# Altium project PWM.PrjPcb
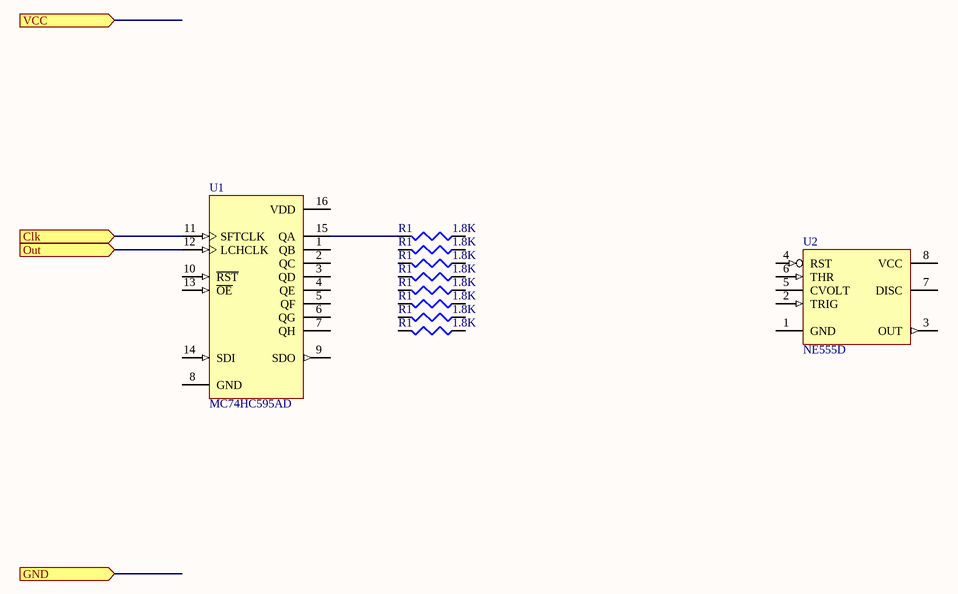
[diagram p0: Output.SchDoc]
1 sheet, 10 parts. Net scope: flat (ports and power ports of the same name join across sheets).

## Sheet Output.SchDoc
size A4

### Parts
(Parts that share a designator on the sheet are numbered #1, #2 ... from top to bottom, then left to right.)
R1#1  value 1.8K  [J1-0603]  (hidden comment: Res3)
R1#2  value 1.8K  [J1-0603]  (hidden comment: Res3)
R1#3  value 1.8K  [J1-0603]  (hidden comment: Res3)
R1#4  value 1.8K  [J1-0603]  (hidden comment: Res3)
R1#5  value 1.8K  [J1-0603]  (hidden comment: Res3)
R1#6  value 1.8K  [J1-0603]  (hidden comment: Res3)
R1#7  value 1.8K  [J1-0603]  (hidden comment: Res3)
R1#8  value 1.8K  [J1-0603]  (hidden comment: Res3)
U1  MC74HC595AD  [751B-05_N]
U2  NE555D  [SO8_N]

### Ports
Clk (in), GND (in), Out (in), VCC (in)

### Nets
NetR1#1_2: R1#1.2 U1.15(QA)
NetU1_11: U1.11(SFTCLK) ; port Clk
NetU1_12: U1.12(LCHCLK) ; port Out

Not connected (* = marked no-connect by the designer): R1#1 1; R1#2 1 2; R1#3 1 2; R1#4 1 2; R1#5 1 2; R1#6 1 2; R1#7 1 2; R1#8 1 2; U1 1(QB) 2(QC) 3(QD) 4(QE) 5(QF) 6(QG) 7(QH) 8(GND) 9(SDO) 10(~{RST}) 13(~{OE}) 14(SDI) 16(VDD); U2 1(GND) 2(TRIG) 3(OUT) 4(RST) 5(CVOLT) 6(THR) 7(DISC) 8(VCC)

### Library data of the parts
R1#1-R1#8 = Res3: Resistor; Published: 8-Jun-2000; LatestRevisionDate: 29-May-2009; LatestRevisionNote: IPC-7351 Footprint Added.; PackageReference: J1-0603; Publisher: Altium Limited; PackageDescription: Chip Resistor
U1 = MC74HC595AD: 8-Bit Serial-Input/Serial or Prallel-Output Shift Register with Latched 3-State Outputs; Published: 15-Apr-2002; LatestRevisionDate: 13-Apr-2006; LatestRevisionNote: IPC-7351 Footprint Added.; DatasheetVersion: Mar-2000; PackageVersion: Oct-1999; PackageReference: 751B-05; Publisher: Altium Limited; PackageDescription: 16-Pin Small Outline Integrated Circuit 1.27 mm Pitch; Code_JEDEC: MS-012-AC; Code_IPC: SOIC127P600-16; ComponentLink1Description: Manufacturer Link; ComponentLink1URL: http://www.onsemi.com/; ComponentLink2Description: Datasheet; ComponentLink2URL: http://www.onsemi.com/pub/Collateral/MC74HC595A-D.PDF
U2 = NE555D: General-Purpose Single Bipolar Timer; Published: 24-Aug-2001; LatestRevisionDate: 13-Apr-2006; LatestRevisionNote: IPC-7351 Footprint Added.; DatasheetVersion: Jul-1998; PackageVersion: Dec-2002; PackageReference: SO8; Publisher: Altium Limited; PackageDescription: 8-Pin Small Outline Integrated Circuit 1.27 mm Pitch; Code_JEDEC: MS-012-AA; Code_IPC: SOIC127P600-8; ComponentLink1Description: Manufacturer Link; ComponentLink1URL: http://www.st.com/; ComponentLink2Description: Datasheet; ComponentLink2URL: http://www.st.com/stonline/products/literature/ds/2182/ne555.pdf